# EAGLE design zxuno_bus_v1 (EAGLE 7.2.0)
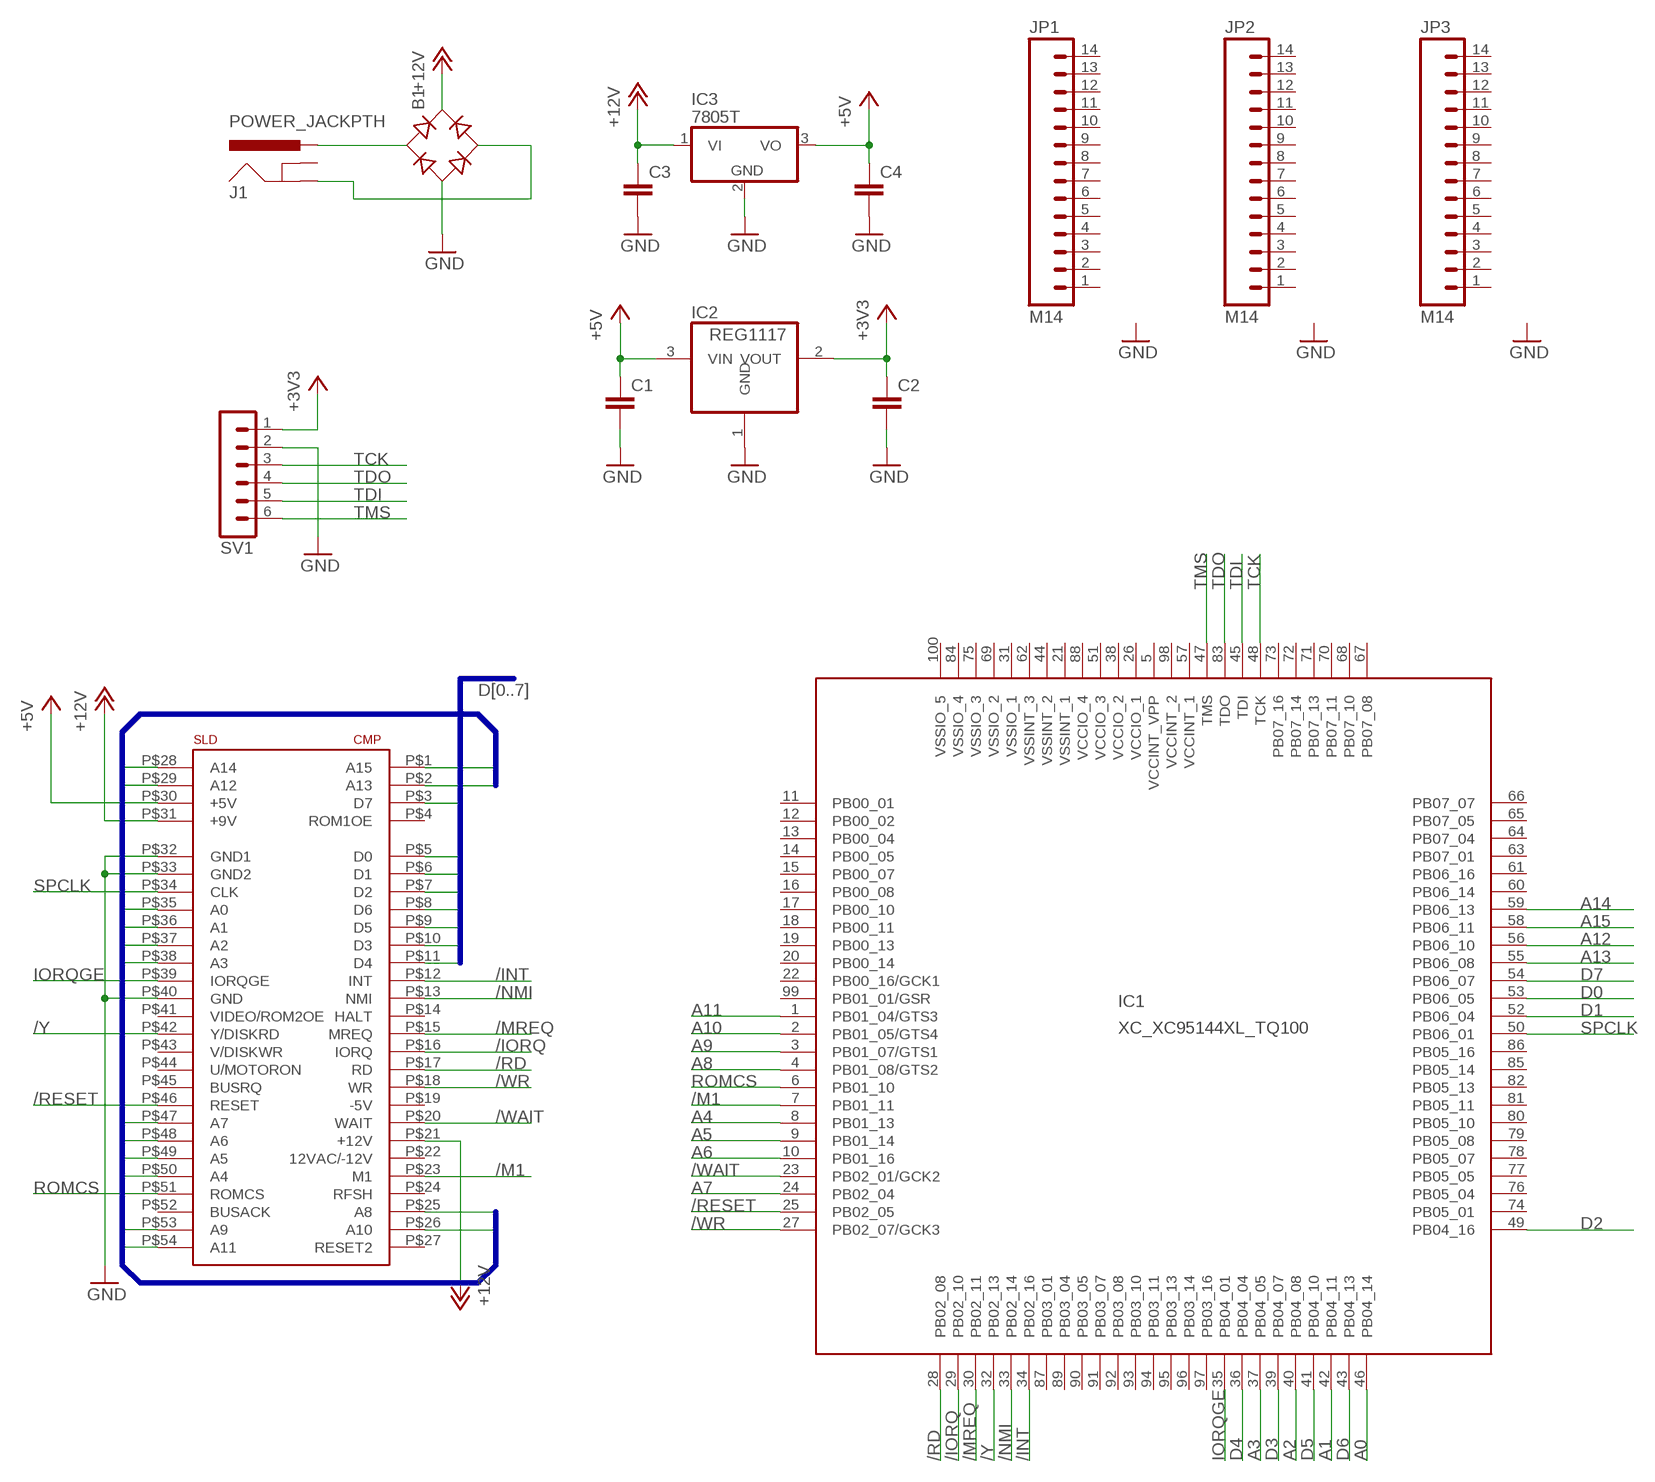
[diagram p0: schematic, sheet 1]

## Parts
B1  RB1A  [RB1A]
C1  C-EUC1206K  [C1206K]
C2  C-EUC1206K  [C1206K]
C3  C-EUC1206K  [C1206K]
C4  C-EUC1206K  [C1206K]
IC1  XC_XC95144XL_TQ100  [XC_XC-TQ100]
IC2  REG1117  [SOT223]
IC3  7805T  [TO220H]
J1  POWER_JACKPTH  [POWER_JACK_PTH]
JP1  M14  [1X14]
JP2  M14  [1X14]
JP3  M14  [1X14]
SV1  MA06-1  [MA06-1]
U$1  CONECTOR_EDGE_LADO_SPECTRUM  [CONECTOR_LADO_SPECTRUM]

## Nets
+3V3: C2.1 IC2.2(VOUT) SV1.1
+5V: C1.1 C4.1 IC2.3(VIN) IC3.3(VO) U$1.P$30(+5V)
+12V: B1.+ C3.1 IC3.1(VI) U$1.P$21(+12V) U$1.P$31(+9V)
/INT: IC1.34(PB02_16) U$1.P$12(INT)
/IORQ: IC1.29(PB02_10) U$1.P$16(IORQ)
/M1: IC1.7(PB01_11) U$1.P$23(M1)
/MREQ: IC1.30(PB02_11) U$1.P$15(MREQ)
/NMI: IC1.33(PB02_14) U$1.P$13(NMI)
/RD: IC1.28(PB02_08) U$1.P$17(RD)
/RESET: IC1.25(PB02_05) U$1.P$46(RESET)
/WAIT: IC1.23(PB02_01/GCK2) U$1.P$20(WAIT)
/WR: IC1.27(PB02_07/GCK3) U$1.P$18(WR)
/Y: IC1.32(PB02_13) U$1.P$42(Y/DISKRD)
A0: IC1.46(PB04_14) U$1.P$35(A0)
A1: IC1.42(PB04_11) U$1.P$36(A1)
A2: IC1.40(PB04_08) U$1.P$37(A2)
A3: IC1.37(PB04_05) U$1.P$38(A3)
A4: IC1.8(PB01_13) U$1.P$50(A4)
A5: IC1.9(PB01_14) U$1.P$49(A5)
A6: IC1.10(PB01_16) U$1.P$48(A6)
A7: IC1.24(PB02_04) U$1.P$47(A7)
A8: IC1.4(PB01_08/GTS2) U$1.P$25(A8)
A9: IC1.3(PB01_07/GTS1) U$1.P$53(A9)
A10: IC1.2(PB01_05/GTS4) U$1.P$26(A10)
A11: IC1.1(PB01_04/GTS3) U$1.P$54(A11)
A12: IC1.56(PB06_10) U$1.P$29(A12)
A13: IC1.55(PB06_08) U$1.P$2(A13)
A14: IC1.59(PB06_13) U$1.P$28(A14)
A15: IC1.58(PB06_11) U$1.P$1(A15)
D0: IC1.53(PB06_05) U$1.P$5(D0)
D1: IC1.52(PB06_04) U$1.P$6(D1)
D2: IC1.49(PB04_16) U$1.P$7(D2)
D3: IC1.39(PB04_07) U$1.P$10(D3)
D4: IC1.36(PB04_04) U$1.P$11(D4)
D5: IC1.41(PB04_10) U$1.P$9(D5)
D6: IC1.43(PB04_13) U$1.P$8(D6)
D7: IC1.54(PB06_07) U$1.P$3(D7)
GND: B1.- C1.2 C2.2 C3.2 C4.2 IC2.1(GND) IC3.2(GND) SV1.2 U$1.P$32(GND1) U$1.P$33(GND2) U$1.P$40(GND)
IORQGE: IC1.35(PB04_01) U$1.P$39(IORQGE)
N$1: B1.AC1 J1.PWR
N$2: B1.AC2 J1.GND
ROMCS: IC1.6(PB01_10) U$1.P$51(ROMCS)
SPCLK: IC1.50(PB06_01) U$1.P$34(CLK)
TCK: IC1.48(TCK) SV1.3
TDI: IC1.45(TDI) SV1.5
TDO: IC1.83(TDO) SV1.4
TMS: IC1.47(TMS) SV1.6
Unconnected: IC1.5(VCCINT_VPP) IC1.11(PB00_01) IC1.12(PB00_02) IC1.13(PB00_04) IC1.14(PB00_05) IC1.15(PB00_07) IC1.16(PB00_08) IC1.17(PB00_10) IC1.18(PB00_11) IC1.19(PB00_13) IC1.20(PB00_14) IC1.21(VSSINT_1) IC1.22(PB00_16/GCK1) IC1.26(VCCIO_1) IC1.31(VSSIO_1) IC1.38(VCCIO_2) IC1.44(VSSINT_2) IC1.51(VCCIO_3) IC1.57(VCCINT_1) IC1.60(PB06_14) IC1.61(PB06_16) IC1.62(VSSINT_3) IC1.63(PB07_01) IC1.64(PB07_04) IC1.65(PB07_05) IC1.66(PB07_07) IC1.67(PB07_08) IC1.68(PB07_10) IC1.69(VSSIO_2) IC1.70(PB07_11) IC1.71(PB07_13) IC1.72(PB07_14) IC1.73(PB07_16) IC1.74(PB05_01) IC1.75(VSSIO_3) IC1.76(PB05_04) IC1.77(PB05_05) IC1.78(PB05_07) IC1.79(PB05_08) IC1.80(PB05_10) IC1.81(PB05_11) IC1.82(PB05_13) IC1.84(VSSIO_4) IC1.85(PB05_14) IC1.86(PB05_16) IC1.87(PB03_01) IC1.88(VCCIO_4) IC1.89(PB03_04) IC1.90(PB03_05) IC1.91(PB03_07) IC1.92(PB03_08) IC1.93(PB03_10) IC1.94(PB03_11) IC1.95(PB03_13) IC1.96(PB03_14) IC1.97(PB03_16) IC1.98(VCCINT_2) IC1.99(PB01_01/GSR) IC1.100(VSSIO_5) J1.GNDBREAK JP1.1 JP1.2 JP1.3 JP1.4 JP1.5 JP1.6 JP1.7 JP1.8 JP1.9 JP1.10 JP1.11 JP1.12 JP1.13 JP1.14 JP2.1 JP2.2 JP2.3 JP2.4 JP2.5 JP2.6 JP2.7 JP2.8 JP2.9 JP2.10 JP2.11 JP2.12 JP2.13 JP2.14 JP3.1 JP3.2 JP3.3 JP3.4 JP3.5 JP3.6 JP3.7 JP3.8 JP3.9 JP3.10 JP3.11 JP3.12 JP3.13 JP3.14 U$1.P$4(ROM1OE) U$1.P$14(HALT) U$1.P$19(-5V) U$1.P$22(12VAC/-12V) U$1.P$24(RFSH) U$1.P$27(RESET2) U$1.P$41(VIDEO/ROM2OE) U$1.P$43(V/DISKWR) U$1.P$44(U/MOTORON) U$1.P$45(BUSRQ) U$1.P$52(BUSACK)

## Buses
D[0..7]
A[0..15]

## Library data of the parts
B1 = rectifier:RB1A: RECTIFIER 1 A
C1-C4 = rcl:C-EU: CAPACITOR, European symbol
IC1 = xilinx:XC_XC95144XL_TQ100: xc95144xl_tq100 edit this description Auto generated by make-symbol-device-package-bsdl.ulp Rev. 34 Source: xc95144xl_tq100.bsd
IC2 = burr-brown:REG1117: 800mA and 1A Low Dropout (LDO) Positive Regulator 1.8V, 2.5V, 2.85V, 3.3V, 5V, and Adj
IC3 = linear:78*: Positive VOLTAGE REGULATOR Source: http://cache.national.com/ds/LM/LM78L05.pdf http://www.fairchildsemi.com/ds/LM/LM7805.pdf
J1 = SparkFun:POWER_JACK: Power Jack This is the standard 5.5mm barrel jack for power. The PTH is the most common, proven, reliable, footprint. All others are experimental. The Slot footprint only works if the mill layer is transmitted to the PCB fab house so be warned. Spark Fun Electronics SKU : PRT-00119. Mating wall wart : TOL-00298 (and others)
JP1-JP3 = SparkFun:M14: Header 14 Standard 14-pin 0.1" header. Use with straight break away headers (SKU : PRT-00116), right angle break away headers (PRT-00553), swiss pins (PRT-00743), machine pins (PRT-00117), and female headers (PRT-00115).
SV1 = con-lstb:MA06-1: PIN HEADER
U$1 = zx_spectrum:CONECTOR_EDGE_LADO_SPECTRUM

## Net classes
0 default: width 0.178 mm, clearance 0.178 mm
1 power: width 0.305 mm, clearance 0.178 mm to class 0, clearance 0.229 mm

## Board
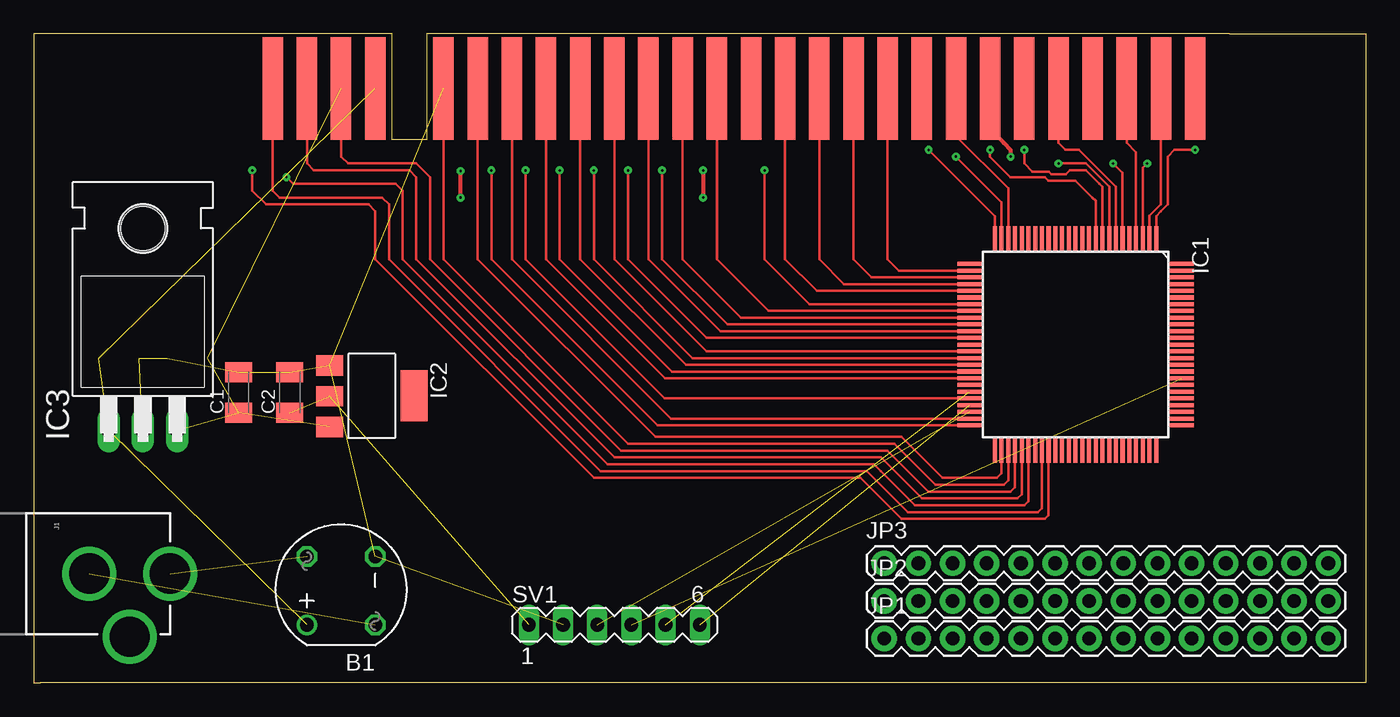
[diagram p1: board, top side]
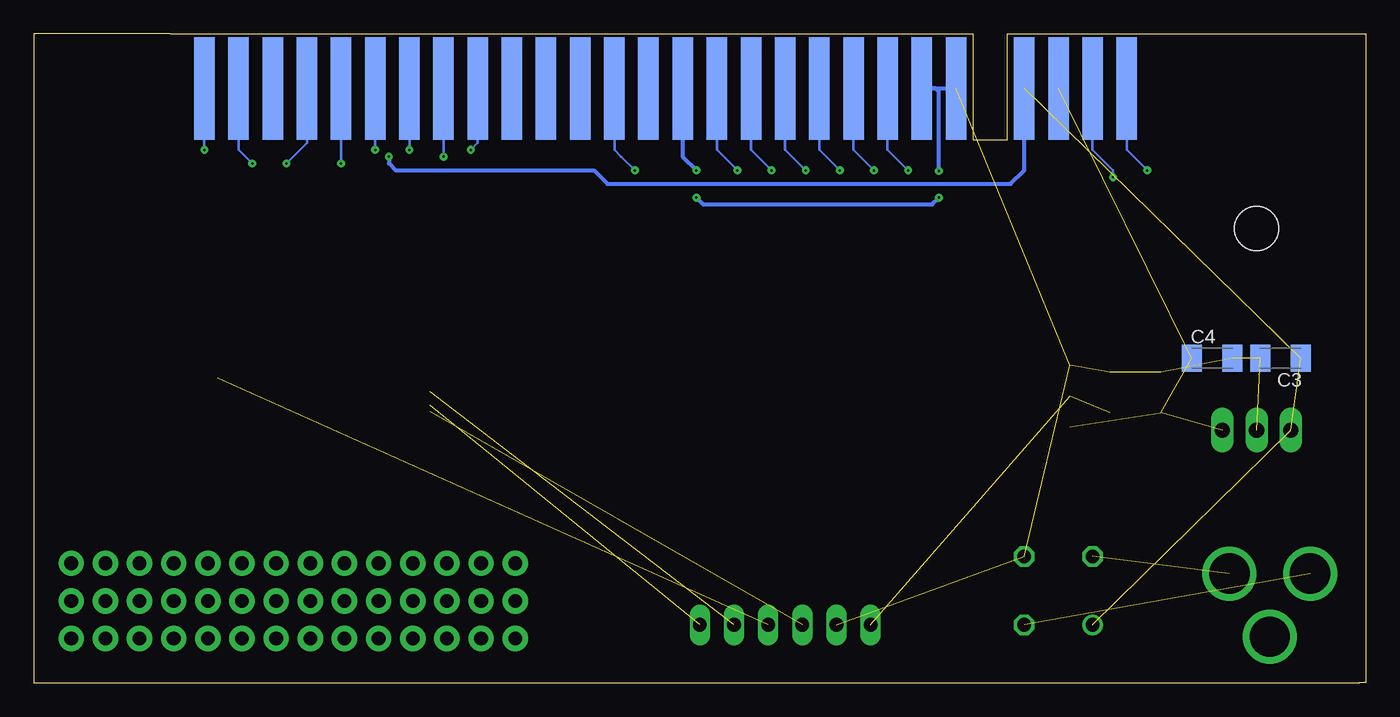
[diagram p2: board, bottom side, seen from below]

Size 99.06 x 48.26 mm. Coordinates in mm from the lower left corner, seen from the top.
Outline: 0,0.02 0,48.26 15.24,48.26
Outline: 88.9,48.26 99.06,48.26 99.06,0 97.54,0 0.51,0 0,0
Copper layers (1*16): Top 0.035mm / dielectric 1.5mm / Bottom 0.035mm
Design rules "default": minimum track width 10mil, minimum drill 24mil, track to track 8mil, track to pad 8mil, pad to pad 8mil, via to via 8mil, smd to smd 8mil, copper to edge 40mil, drill to drill 8mil, minimum pad ring 10mil, minimum via ring 8mil, stop-mask expansion 4mil, vias tented up to drill 0mil, thermal gap 10mil

### Footprints (pad centres in the part's own frame; a part is rotated, then mirrored left to right if it is on the bottom)
RB1A = drill 1.016: + -2.54,2.54 | drill 1.016 octagon: - 2.54,-2.54; AC1 2.54,2.54; AC2 -2.54,-2.54
C1206K = smd 1.5 x 2: 1 -1.5,0; 2 1.5,0
XC_XC-TQ100 = smd 1.8 x 0.3: 1 -7.9,6; 2 -7.9,5.5; 3 -7.9,5; 4 -7.9,4.5; 5 -7.9,4; 6 -7.9,3.5; 7 -7.9,3; 8 -7.9,2.5; 9 -7.9,2; 10 -7.9,1.5; 11 -7.9,1; 12 -7.9,0.5; 13 -7.9,0; 14 -7.9,-0.5; 15 -7.9,-1; 16 -7.9,-1.5; 17 -7.9,-2; 18 -7.9,-2.5; 19 -7.9,-3; 20 -7.9,-3.5; 21 -7.9,-4; 22 -7.9,-4.5; 23 -7.9,-5; 24 -7.9,-5.5; 25 -7.9,-6; 51 7.9,-6; 52 7.9,-5.5; 53 7.9,-5; 54 7.9,-4.5; 55 7.9,-4; 56 7.9,-3.5; 57 7.9,-3; 58 7.9,-2.5; 59 7.9,-2; 60 7.9,-1.5; 61 7.9,-1; 62 7.9,-0.5; 63 7.9,0; 64 7.9,0.5; 65 7.9,1; 66 7.9,1.5; 67 7.9,2; 68 7.9,2.5; 69 7.9,3; 70 7.9,3.5; 71 7.9,4; 72 7.9,4.5; 73 7.9,5; 74 7.9,5.5; 75 7.9,6 | smd 0.3 x 1.8: 26 -6,-7.9; 27 -5.5,-7.9; 28 -5,-7.9; 29 -4.5,-7.9; 30 -4,-7.9; 31 -3.5,-7.9; 32 -3,-7.9; 33 -2.5,-7.9; 34 -2,-7.9; 35 -1.5,-7.9; 36 -1,-7.9; 37 -0.5,-7.9; 38 0,-7.9; 39 0.5,-7.9; 40 1,-7.9; 41 1.5,-7.9; 42 2,-7.9; 43 2.5,-7.9; 44 3,-7.9; 45 3.5,-7.9; 46 4,-7.9; 47 4.5,-7.9; 48 5,-7.9; 49 5.5,-7.9; 50 6,-7.9; 76 6,7.9; 77 5.5,7.9; 78 5,7.9; 79 4.5,7.9; 80 4,7.9; 81 3.5,7.9; 82 3,7.9; 83 2.5,7.9; 84 2,7.9; 85 1.5,7.9; 86 1,7.9; 87 0.5,7.9; 88 0,7.9; 89 -0.5,7.9; 90 -1,7.9; 91 -1.5,7.9; 92 -2,7.9; 93 -2.5,7.9; 94 -3,7.9; 95 -3.5,7.9; 96 -4,7.9; 97 -4.5,7.9; 98 -5,7.9; 99 -5.5,7.9; 100 -6,7.9
SOT223 = smd 1.499 x 2.007: 1 -2.261,-3.15; 2 0.025,-3.15; 3 2.311,-3.15 | smd 3.81 x 2.007: 4 0,3.15
TO220H = drill 1.118 long: 1 -2.54,-10.16; 2 0,-10.16; 3 2.54,-10.16 | hole 3.302: 0,4.826
POWER_JACK_PTH = drill 2.997: GND 0,7.7; GNDBREAK 4.7,10.7; PWR 0,13.7
1X14 = drill 1.016 pad 1.88: 1 0,0; 2 2.54,0; 3 5.08,0; 4 7.62,0; 5 10.16,0; 6 12.7,0; 7 15.24,0; 8 17.78,0; 9 20.32,0; 10 22.86,0; 11 25.4,0; 12 27.94,0; 13 30.48,0; 14 33.02,0
MA06-1 = drill 1.016 long: 1 -6.35,0; 2 -3.81,0; 3 -1.27,0; 4 1.27,0; 5 3.81,0; 6 6.35,0
CONECTOR_LADO_SPECTRUM = smd 7.62 x 1.524: P$1 2.54,2.54; P$2 2.54,0; P$3 2.54,-2.54; P$4 2.54,-5.08; P$5 2.54,-10.16; P$6 2.54,-12.7; P$7 2.54,-15.24; P$8 2.54,-17.78; P$9 2.54,-20.32; P$10 2.54,-22.86; P$11 2.54,-25.4; P$12 2.54,-27.94; P$13 2.54,-30.48; P$14 2.54,-33.02; P$15 2.54,-35.56; P$16 2.54,-38.1; P$17 2.54,-40.64; P$18 2.54,-43.18; P$19 2.54,-45.72; P$20 2.54,-48.26; P$21 2.54,-50.8; P$22 2.54,-53.34; P$23 2.54,-55.88; P$24 2.54,-58.42; P$25 2.54,-60.96; P$26 2.54,-63.5; P$27 2.54,-66.04 | smd 7.62 x 1.524 bottom: P$28 2.54,2.54; P$29 2.54,0; P$30 2.54,-2.54; P$31 2.54,-5.08; P$32 2.54,-10.16; P$33 2.54,-12.7; P$34 2.54,-15.24; P$35 2.54,-17.78; P$36 2.54,-20.32; P$37 2.54,-22.86; P$38 2.54,-25.4; P$39 2.54,-27.94; P$40 2.54,-30.48; P$41 2.54,-33.02; P$42 2.54,-35.56; P$43 2.54,-38.1; P$44 2.54,-40.64; P$45 2.54,-43.18; P$46 2.54,-45.72; P$47 2.54,-48.26; P$48 2.54,-50.8; P$49 2.54,-53.34; P$50 2.54,-55.88; P$51 2.54,-58.42; P$52 2.54,-60.96; P$53 2.54,-63.5; P$54 2.54,-66.04

### Placement (x,y rotation side)
B1  22.86,6.86 90 top
C1  15.24,21.59 90 top
C2  19.05,21.59 90 top
C3  6.35,24.13 180 bottom
C4  11.43,24.13 0 bottom
IC1  77.47,25.15 270 top
IC2  25.15,21.34 270 top
IC3  8.13,28.96 0 top
J1  -3.56,8.13 270 top
JP1  63.25,3.3 0 top
JP2  63.25,6.1 0 top
JP3  63.25,8.89 0 top
SV1  43.18,4.32 0 top
U$1  20.32,41.66 90 top

### Tracks (layer width: path | path; a pad name or v marks a point on that pad's centre or on a via)
+3V3  (2 unrouted)
+5V  (4 unrouted)
+12V  (via drill 0.18 pad 0.3)  (3 unrouted)
  Top 0.305: U$1.P$21 71.12,41.15 72.14,40.13 72.64,39.62 v72.64,39.12
  Bottom 0.305: v72.64,39.12 72.64,38.61 72.14,38.1 57.4,38.1 56.39,37.08 26.42,37.08 25.4,38.1 U$1.P$31
/INT
  Top 0.178: IC1.34 52.61,27.15 48.26,31.5 U$1.P$12
/IORQ
  Top 0.178: IC1.29 60.27,29.65 58.42,31.5 U$1.P$16
/M1
  Top 0.178: IC1.7 80.47,35.86 80.47,36.88 77.72,39.62 76.71,39.62 76.2,40.13 U$1.P$23
/MREQ
  Top 0.178: IC1.30 58.23,29.15 55.88,31.5 U$1.P$15
/NMI
  Top 0.178: IC1.33 54.65,27.65 50.8,31.5 U$1.P$13
/RD
  Top 0.178: IC1.28 62.31,30.15 60.96,31.5 U$1.P$17
/RESET  (via drill 0.18 pad 0.3)
  Top 0.178: IC1.25 71.47,34.7 v66.55,39.62
  Bottom 0.178: v66.55,39.62 66.04,40.13 U$1.P$46
/WAIT
  Top 0.178: IC1.23 72.47,36.75 68.58,40.64 U$1.P$20
/WR
  Top 0.178: IC1.27 64.35,30.65 63.5,31.5 U$1.P$18
/Y  (via drill 0.18 pad 0.3)
  Top 0.178: IC1.32 57.71,28.15 54.36,31.5 v54.36,38.1
  Bottom 0.178: 55.37,39.12 v54.36,38.1 55.37,39.12 | 55.37,39.12 55.88,39.62 U$1.P$42
A0  (via drill 0.18 pad 0.3)
  Top 0.178: IC1.46 46.93,21.15 36.58,31.5 v36.58,38.1
  Bottom 0.178: v36.58,38.1 38.1,39.62 U$1.P$35
A1  (via drill 0.18 pad 0.3)
  Top 0.178: IC1.42 47.47,23.15 39.12,31.5 v39.12,38.1
  Bottom 0.178: v39.12,38.1 40.64,39.62 U$1.P$36
A2  (via drill 0.18 pad 0.3)
  Top 0.178: IC1.40 49.01,24.15 41.66,31.5 v41.66,38.1
  Bottom 0.178: v41.66,38.1 43.18,39.62 U$1.P$37
A3  (via drill 0.18 pad 0.3)
  Top 0.178: IC1.37 50.05,25.65 44.2,31.5 v44.2,38.1
  Bottom 0.178: v44.2,38.1 45.72,39.62 U$1.P$38
A4  (via drill 0.18 pad 0.3)
  Top 0.178: IC1.8 79.97,34.84 79.97,36.87 78.23,38.61 v76.2,38.61
  Bottom 0.178: v76.2,38.61 U$1.P$50
A5  (via drill 0.18 pad 0.3)
  Top 0.178: IC1.9 79.47,36.86 79.25,37.08 78.23,38.1 77.06,38.1 76.76,37.8 75.69,37.8 75.49,38 74.27,38 73.66,38.61 v73.66,39.62
  Bottom 0.178: 73.66,40.13 v73.66,39.62 73.66,40.13 | 73.66,40.13 U$1.P$49
A6  (via drill 0.18 pad 0.3)
  Top 0.178: IC1.10 78.97,35.84 78.74,36.07 77.47,37.34 75.44,37.34 75.18,37.59 72.64,37.59 71.12,39.12 v71.12,39.62
  Bottom 0.178: U$1.P$48 71.12,40.13 v71.12,39.62
A7  (via drill 0.18 pad 0.3)
  Top 0.178: IC1.24 71.97,35.73 v68.58,39.12
  Bottom 0.178: v68.58,39.12 U$1.P$47
A8
  Top 0.178: IC1.4 81.97,39.44 81.28,40.13 U$1.P$25
A9  (via drill 0.18)
  Top 0.178: IC1.3 82.47,38.27 v82.8,38.61
  Bottom 0.178: v82.8,38.61 83.82,39.62 U$1.P$53
A10
  Top 0.178: IC1.2 82.97,34.71 83.82,35.56 U$1.P$26
A11  (via drill 0.18 pad 0.3)
  Top 0.178: IC1.1 83.47,34.19 83.47,34.7 83.82,35.05 84.33,35.56 84.33,39.12 84.84,39.62 v86.36,39.62
  Bottom 0.178: v86.36,39.62 U$1.P$54
A12  (via drill 0.18 pad 0.3)
  Top 0.178: IC1.56 73.97,13.52 73.66,13.21 65.53,13.21 62.99,15.75 62.48,16.26 42.67,16.26 27.43,31.5 27.43,36.58 26.92,37.08 19.3,37.08 v18.8,37.59
  Bottom 0.178: v18.8,37.59 18.8,38.1 20.32,39.62 U$1.P$29
A13
  Top 0.178: IC1.55 73.47,14.03 73.15,13.72 66.04,13.72 62.99,16.76 43.18,16.76 28.45,31.5 28.45,37.59 27.94,38.1 20.83,38.1 20.32,38.61 U$1.P$2
A14  (via drill 0.18 pad 0.3)
  Top 0.178: IC1.59 75.47,12.48 75.18,12.19 64.52,12.19 61.47,15.24 41.66,15.24 25.4,31.5 25.4,35.05 24.89,35.56 17.27,35.56 16.26,36.58 v16.26,38.1
  Bottom 0.178: v16.26,38.1 17.78,39.62 U$1.P$28
A15
  Top 0.178: IC1.58 74.97,12.99 74.68,12.7 65.02,12.7 61.98,15.75 42.16,15.75 26.42,31.5 26.42,35.56 25.91,36.07 18.29,36.07 17.78,36.58 U$1.P$1
D0
  Top 0.178: IC1.53 72.47,15.07 72.14,14.73 67.06,14.73 64.01,17.78 44.2,17.78 30.48,31.5 U$1.P$5
D1
  Top 0.178: IC1.52 71.97,15.58 71.63,15.24 67.56,15.24 64.52,18.29 46.23,18.29 33.02,31.5 U$1.P$6
D2
  Top 0.178: IC1.49 47.41,19.65 35.56,31.5 U$1.P$7
D3
  Top 0.178: IC1.39 50.03,24.65 43.18,31.5 U$1.P$10
D4
  Top 0.178: IC1.36 51.07,26.15 45.72,31.5 U$1.P$11
D5
  Top 0.178: IC1.41 48.49,23.65 40.64,31.5 U$1.P$9
D6
  Top 0.178: IC1.43 46.95,22.65 38.1,31.5 U$1.P$8
D7
  Top 0.178: IC1.54 72.97,14.55 72.64,14.22 66.55,14.22 63.5,17.27 43.69,17.27 29.46,31.5 29.46,37.59 28.45,38.61 23.37,38.61 22.86,39.12 U$1.P$3
GND  (via drill 0.18 pad 0.3)  (8 unrouted)
  Top 0.305: v49.78,38.1 v49.78,36.07 | v31.75,36.07 v31.75,38.05
  Bottom 0.305: U$1.P$40 50.8,39.12 v49.78,38.1 | v49.78,36.07 49.28,35.56 32.26,35.56 v31.75,36.07 | v31.75,38.05 31.75,43.94 32,44.2 U$1.P$33 U$1.P$32
IORQGE  (via drill 0.18 pad 0.3)
  Top 0.178: IC1.35 51.59,26.65 46.74,31.5 v46.74,38.1
  Bottom 0.178: v46.74,38.1 48.26,39.62 U$1.P$39
N$1  (1 unrouted)
N$2  (1 unrouted)
ROMCS  (via drill 0.18)
  Top 0.178: IC1.6 80.97,37.9 v80.26,38.61
  Bottom 0.178: v80.26,38.61 78.74,40.13 U$1.P$51
SPCLK  (via drill 0.18 pad 0.3)
  Top 0.178: IC1.50 46.39,19.15 34.04,31.5 v34.04,38.1
  Bottom 0.178: v34.04,38.1 35.56,39.62 U$1.P$34
TCK  (1 unrouted)
TDI  (1 unrouted)
TDO  (1 unrouted)
TMS  (1 unrouted)